# Altium project Phaser.PrjPCB (part 4 of 5)

## Sheet FPGA_DAC.SchDoc: Phaser
size 420 x 297 mm; EDA_Number: ARTIQ; Projet: ARTIQ/SINARA; Author: G.Kasprowicz; CompanyName: WUT ISE; DrawnBy: G.Kasprowicz; Organization: WUT ISE; Address1: PW ISE; Address2: Nowowiejska 15/19 00-665 Warsaw; Address3: gkasprow@gmail.com; Revision: 2; SheetNumber: -; SheetTotal: -; ModifiedBy: -; CheckedDate: -; Title2: xxx; DivGrp: WUT ISE; Designer: G.Kasprowicz; ModifiedDate: -; ProjectName: Sensor Box
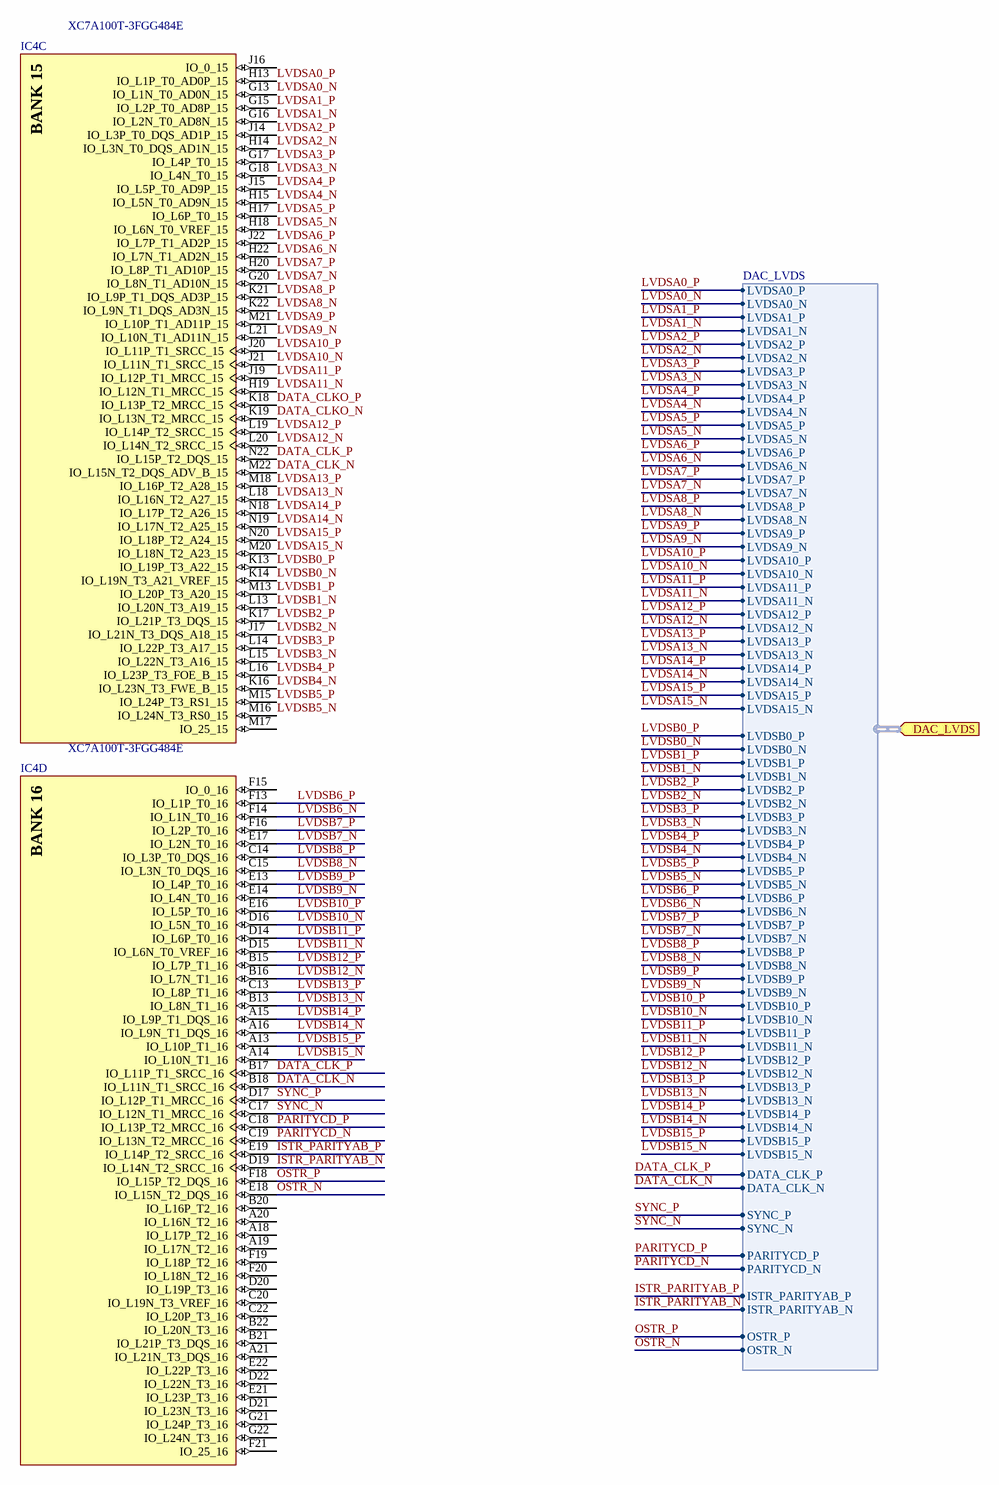
[diagram p8: FPGA_DAC.SchDoc]

### Parts
IC4  XC7A100T-3FGG484E  [FGG484]  (parts C,D of 10)

### Ports
DAC_LVDS (in, harness DAC_LVDS)

### Harnesses
DAC_LVDS: LVDSA0_P, LVDSA0_N, LVDSA1_P, LVDSA1_N, LVDSA2_P, LVDSA2_N, LVDSA3_P, LVDSA3_N, LVDSA4_P, LVDSA4_N, LVDSA5_P, LVDSA5_N, LVDSA6_P, LVDSA6_N, LVDSA7_P, LVDSA7_N, LVDSA8_P, LVDSA8_N, LVDSA9_P, LVDSA9_N, LVDSA10_P, LVDSA10_N, LVDSA11_P, LVDSA11_N, LVDSA12_P, LVDSA12_N, LVDSA13_P, LVDSA13_N, LVDSA14_P, LVDSA14_N, LVDSA15_P, LVDSA15_N, LVDSB0_P, LVDSB0_N, LVDSB1_P, LVDSB1_N, LVDSB2_P, LVDSB2_N, LVDSB3_P, LVDSB3_N, LVDSB4_P, LVDSB4_N, LVDSB5_P, LVDSB5_N, LVDSB6_P, LVDSB6_N, LVDSB7_P, LVDSB7_N, LVDSB8_P, LVDSB8_N, LVDSB9_P, LVDSB9_N, LVDSB10_P, LVDSB10_N, LVDSB11_P, LVDSB11_N, LVDSB12_P, LVDSB12_N, LVDSB13_P, LVDSB13_N, LVDSB14_P, LVDSB14_N, LVDSB15_P, LVDSB15_N, DATA_CLK_P, DATA_CLK_N, SYNC_P, SYNC_N, PARITYCD_P, PARITYCD_N, ISTR_PARITYAB_P, ISTR_PARITYAB_N, OSTR_P, OSTR_N

### Nets
DATA_CLK_N: IC4.B18(IO_L11N_T1_SRCC_16) IC4.M22(IO_L15N_T2_DQS_ADV_B_15) ; port DAC_LVDS.DATA_CLK_N
DATA_CLK_P: IC4.B17(IO_L11P_T1_SRCC_16) IC4.N22(IO_L15P_T2_DQS_15) ; port DAC_LVDS.DATA_CLK_P
DATA_CLKO_N: IC4.K19(IO_L13N_T2_MRCC_15)
DATA_CLKO_P: IC4.K18(IO_L13P_T2_MRCC_15)
ISTR_PARITYAB_N: IC4.D19(IO_L14N_T2_SRCC_16) ; port DAC_LVDS.ISTR_PARITYAB_N
ISTR_PARITYAB_P: IC4.E19(IO_L14P_T2_SRCC_16) ; port DAC_LVDS.ISTR_PARITYAB_P
LVDSA0_N: IC4.G13(IO_L1N_T0_AD0N_15) ; port DAC_LVDS.LVDSA0_N
LVDSA0_P: IC4.H13(IO_L1P_T0_AD0P_15) ; port DAC_LVDS.LVDSA0_P
LVDSA1_N: IC4.G16(IO_L2N_T0_AD8N_15) ; port DAC_LVDS.LVDSA1_N
LVDSA1_P: IC4.G15(IO_L2P_T0_AD8P_15) ; port DAC_LVDS.LVDSA1_P
LVDSA2_N: IC4.H14(IO_L3N_T0_DQS_AD1N_15) ; port DAC_LVDS.LVDSA2_N
LVDSA2_P: IC4.J14(IO_L3P_T0_DQS_AD1P_15) ; port DAC_LVDS.LVDSA2_P
LVDSA3_N: IC4.G18(IO_L4N_T0_15) ; port DAC_LVDS.LVDSA3_N
LVDSA3_P: IC4.G17(IO_L4P_T0_15) ; port DAC_LVDS.LVDSA3_P
LVDSA4_N: IC4.H15(IO_L5N_T0_AD9N_15) ; port DAC_LVDS.LVDSA4_N
LVDSA4_P: IC4.J15(IO_L5P_T0_AD9P_15) ; port DAC_LVDS.LVDSA4_P
LVDSA5_N: IC4.H18(IO_L6N_T0_VREF_15) ; port DAC_LVDS.LVDSA5_N
LVDSA5_P: IC4.H17(IO_L6P_T0_15) ; port DAC_LVDS.LVDSA5_P
LVDSA6_N: IC4.H22(IO_L7N_T1_AD2N_15) ; port DAC_LVDS.LVDSA6_N
LVDSA6_P: IC4.J22(IO_L7P_T1_AD2P_15) ; port DAC_LVDS.LVDSA6_P
LVDSA7_N: IC4.G20(IO_L8N_T1_AD10N_15) ; port DAC_LVDS.LVDSA7_N
LVDSA7_P: IC4.H20(IO_L8P_T1_AD10P_15) ; port DAC_LVDS.LVDSA7_P
LVDSA8_N: IC4.K22(IO_L9N_T1_DQS_AD3N_15) ; port DAC_LVDS.LVDSA8_N
LVDSA8_P: IC4.K21(IO_L9P_T1_DQS_AD3P_15) ; port DAC_LVDS.LVDSA8_P
LVDSA9_N: IC4.L21(IO_L10N_T1_AD11N_15) ; port DAC_LVDS.LVDSA9_N
LVDSA9_P: IC4.M21(IO_L10P_T1_AD11P_15) ; port DAC_LVDS.LVDSA9_P
LVDSA10_N: IC4.J21(IO_L11N_T1_SRCC_15) ; port DAC_LVDS.LVDSA10_N
LVDSA10_P: IC4.J20(IO_L11P_T1_SRCC_15) ; port DAC_LVDS.LVDSA10_P
LVDSA11_N: IC4.H19(IO_L12N_T1_MRCC_15) ; port DAC_LVDS.LVDSA11_N
LVDSA11_P: IC4.J19(IO_L12P_T1_MRCC_15) ; port DAC_LVDS.LVDSA11_P
LVDSA12_N: IC4.L20(IO_L14N_T2_SRCC_15) ; port DAC_LVDS.LVDSA12_N
LVDSA12_P: IC4.L19(IO_L14P_T2_SRCC_15) ; port DAC_LVDS.LVDSA12_P
LVDSA13_N: IC4.L18(IO_L16N_T2_A27_15) ; port DAC_LVDS.LVDSA13_N
LVDSA13_P: IC4.M18(IO_L16P_T2_A28_15) ; port DAC_LVDS.LVDSA13_P
LVDSA14_N: IC4.N19(IO_L17N_T2_A25_15) ; port DAC_LVDS.LVDSA14_N
LVDSA14_P: IC4.N18(IO_L17P_T2_A26_15) ; port DAC_LVDS.LVDSA14_P
LVDSA15_N: IC4.M20(IO_L18N_T2_A23_15) ; port DAC_LVDS.LVDSA15_N
LVDSA15_P: IC4.N20(IO_L18P_T2_A24_15) ; port DAC_LVDS.LVDSA15_P
LVDSB0_N: IC4.K14(IO_L19N_T3_A21_VREF_15) ; port DAC_LVDS.LVDSB0_N
LVDSB0_P: IC4.K13(IO_L19P_T3_A22_15) ; port DAC_LVDS.LVDSB0_P
LVDSB1_N: IC4.L13(IO_L20N_T3_A19_15) ; port DAC_LVDS.LVDSB1_N
LVDSB1_P: IC4.M13(IO_L20P_T3_A20_15) ; port DAC_LVDS.LVDSB1_P
LVDSB2_N: IC4.J17(IO_L21N_T3_DQS_A18_15) ; port DAC_LVDS.LVDSB2_N
LVDSB2_P: IC4.K17(IO_L21P_T3_DQS_15) ; port DAC_LVDS.LVDSB2_P
LVDSB3_N: IC4.L15(IO_L22N_T3_A16_15) ; port DAC_LVDS.LVDSB3_N
LVDSB3_P: IC4.L14(IO_L22P_T3_A17_15) ; port DAC_LVDS.LVDSB3_P
LVDSB4_N: IC4.K16(IO_L23N_T3_FWE_B_15) ; port DAC_LVDS.LVDSB4_N
LVDSB4_P: IC4.L16(IO_L23P_T3_FOE_B_15) ; port DAC_LVDS.LVDSB4_P
LVDSB5_N: IC4.M16(IO_L24N_T3_RS0_15) ; port DAC_LVDS.LVDSB5_N
LVDSB5_P: IC4.M15(IO_L24P_T3_RS1_15) ; port DAC_LVDS.LVDSB5_P
LVDSB6_N: IC4.F14(IO_L1N_T0_16) ; port DAC_LVDS.LVDSB6_N
LVDSB6_P: IC4.F13(IO_L1P_T0_16) ; port DAC_LVDS.LVDSB6_P
LVDSB7_N: IC4.E17(IO_L2N_T0_16) ; port DAC_LVDS.LVDSB7_N
LVDSB7_P: IC4.F16(IO_L2P_T0_16) ; port DAC_LVDS.LVDSB7_P
LVDSB8_N: IC4.C15(IO_L3N_T0_DQS_16) ; port DAC_LVDS.LVDSB8_N
LVDSB8_P: IC4.C14(IO_L3P_T0_DQS_16) ; port DAC_LVDS.LVDSB8_P
LVDSB9_N: IC4.E14(IO_L4N_T0_16) ; port DAC_LVDS.LVDSB9_N
LVDSB9_P: IC4.E13(IO_L4P_T0_16) ; port DAC_LVDS.LVDSB9_P
LVDSB10_N: IC4.D16(IO_L5N_T0_16) ; port DAC_LVDS.LVDSB10_N
LVDSB10_P: IC4.E16(IO_L5P_T0_16) ; port DAC_LVDS.LVDSB10_P
LVDSB11_N: IC4.D15(IO_L6N_T0_VREF_16) ; port DAC_LVDS.LVDSB11_N
LVDSB11_P: IC4.D14(IO_L6P_T0_16) ; port DAC_LVDS.LVDSB11_P
LVDSB12_N: IC4.B16(IO_L7N_T1_16) ; port DAC_LVDS.LVDSB12_N
LVDSB12_P: IC4.B15(IO_L7P_T1_16) ; port DAC_LVDS.LVDSB12_P
LVDSB13_N: IC4.B13(IO_L8N_T1_16) ; port DAC_LVDS.LVDSB13_N
LVDSB13_P: IC4.C13(IO_L8P_T1_16) ; port DAC_LVDS.LVDSB13_P
LVDSB14_N: IC4.A16(IO_L9N_T1_DQS_16) ; port DAC_LVDS.LVDSB14_N
LVDSB14_P: IC4.A15(IO_L9P_T1_DQS_16) ; port DAC_LVDS.LVDSB14_P
LVDSB15_N: IC4.A14(IO_L10N_T1_16) ; port DAC_LVDS.LVDSB15_N
LVDSB15_P: IC4.A13(IO_L10P_T1_16) ; port DAC_LVDS.LVDSB15_P
OSTR_N: IC4.E18(IO_L15N_T2_DQS_16) ; port DAC_LVDS.OSTR_N
OSTR_P: IC4.F18(IO_L15P_T2_DQS_16) ; port DAC_LVDS.OSTR_P
PARITYCD_N: IC4.C19(IO_L13N_T2_MRCC_16) ; port DAC_LVDS.PARITYCD_N
PARITYCD_P: IC4.C18(IO_L13P_T2_MRCC_16) ; port DAC_LVDS.PARITYCD_P
SYNC_N: IC4.C17(IO_L12N_T1_MRCC_16) ; port DAC_LVDS.SYNC_N
SYNC_P: IC4.D17(IO_L12P_T1_MRCC_16) ; port DAC_LVDS.SYNC_P

Not connected (* = marked no-connect by the designer): IC4 A18(IO_L17P_T2_16) A19(IO_L17N_T2_16) A20(IO_L16N_T2_16) A21(IO_L21N_T3_DQS_16) B20(IO_L16P_T2_16) B21(IO_L21P_T3_DQS_16) B22(IO_L20N_T3_16) C20(IO_L19N_T3_VREF_16) C22(IO_L20P_T3_16) D20(IO_L19P_T3_16) D21(IO_L23N_T3_16) D22(IO_L22N_T3_16) E21(IO_L23P_T3_16) E22(IO_L22P_T3_16) F15(IO_0_16) F19(IO_L18P_T2_16) F20(IO_L18N_T2_16) F21(IO_25_16) G21(IO_L24P_T3_16) G22(IO_L24N_T3_16) J16(IO_0_15) M17(IO_25_15)

### Notes on the sheet
- Project/Equipment
- Document
- Designer
- Drawn by
- Check.by
- Copyright WUT ISE 2018.
  This documentation describes Open Hardware and is licensed under the CERN OHL v.1.1. You may redistribute and modify this documentation under the terms of the CERN OHL v.1.1. (http://ohwr.org/CERNOHL). This documentation is distributed WITHOUT ANY EXPRESS OR IMPLIED WARRANTY, INCLUDING OF MERCHANTABILITY, SATISFACTORY QUALITY AND FITNESS FOR A PARTICULAR PURPOSE. Please see the CERN OHL v.1.1 for applicable conditions.
- Contact
- File
- Last Mod.
- Print Date
- Sheet
- Size
- A3
- of
- Rev
- (in symbol CMP-0364-00028-3, part C) BANK 15
- (in symbol CMP-0364-00028-3, part D) BANK 16

### Library data of the parts
IC4 = CMP-0364-00028-3: Artix-7 FPGA, 285 User I/Os, 4 GTP, 484-Ball BGA, Speed Grade 3, Extended Grade, Pb-Free; Manufacturer: Xilinx; Max User I/O: 300; Clock Mgmt Tiles (CMTs): 6; Logic Cells: 101440; Block RAM Blocks (36Kb): 135; Block RAM Blocks (18Kb): 270; Speed Grade: -3; CLBs (Slices): 15850; Block RAM Blocks (Max Kb): 4860; DSP48E1 Slices: 240; RoHS: Pb-Free; ComponentLink3URL: http://www.xilinx.com/support/documentation/data_sheets/ds181_Artix_7_Data_Sheet.pdf; NexusDeviceID: XC7A100T-3FGG484E; DatasheetVersion: v1.12; Mounting Technology: Surface Mount; PackageDescription: Wire-Bond Fine-Pitch BGA, Body 23 x 23 mm, 1.0 mm Pitch; PackageReference: FGG484; ComponentLink2Description: Package Specification; Code_JEDEC: MS-034-AAJ-1; ComponentLink2URL: http://www.xilinx.com/support/documentation/user_guides/ug475_7Series_Pkg_Pinout.pdf; ComponentLink3Description: DC and Switching Characteristics; Generic Part Number: XC7A100T; ComponentLink4Description: Package File; ComponentLink4URL: http://www.xilinx.com/support/packagefiles/a7packages/xc7a100tfgg484pkg.txt; ComponentLink1URL: http://www.xilinx.com/support/documentation/data_sheets/ds180_7Series_Overview.pdf; PartNumber: XC7A100T-3FGG484E; ComponentLink5URL: http://www.xilinx.com/support/documentation/user_guides/ug475_7Series_Pkg_Pinout.pdf; PackageVersion: Rev 1.8; ComponentLink5Description: Packaging and Pinout; ComponentLink1Description: Datasheet; CLBs (Max Distributed RAM Kb): 1188

## Sheet DAC_SUPPLY.SchDoc: Phaser
size 420 x 297 mm; Author: G.Kasprowicz; CompanyName: WUT ISE; DrawnBy: G.Kasprowicz; Organization: WUT ISE; Address1: PW ISE; Address2: Nowowiejska 15/19 00-665 Warsaw; Address3: gkasprow@gmail.com; Revision: 2; SheetNumber: -; SheetTotal: -; ModifiedBy: -; CheckedDate: -; Title2: xxx; DivGrp: WUT ISE; Designer: G.Kasprowicz; ModifiedDate: -; ProjectName: Sensor Box
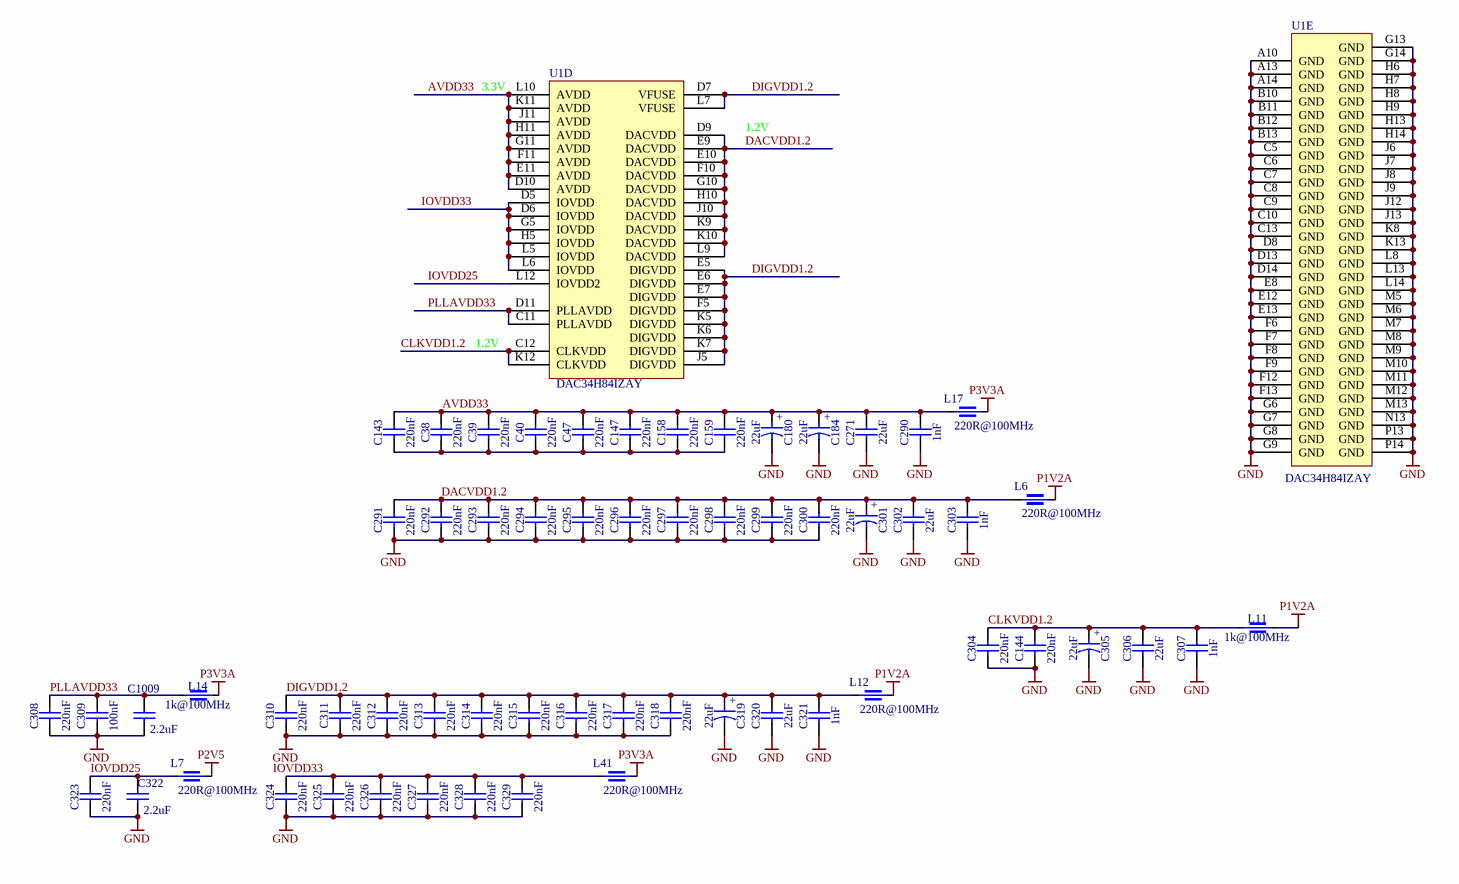
[diagram p9: DAC_SUPPLY.SchDoc]

### Parts
C38  220nF  [CAPC0603X33N]
C39  220nF  [CAPC0603X33N]
C40  220nF  [CAPC0603X33N]
C47  220nF  [CAPC0603X33N]
C143  220nF  [CAPC0603X33N]
C144  220nF  [CAPC0603X33N]
C147  220nF  [CAPC0603X33N]
C158  220nF  [CAPC0603X33N]
C159  220nF  [CAPC0603X33N]
C180  22uF  [CAPMP3528X210N]
C184  22uF  [CAPMP3528X210N]
C271  22uF  [CAPC1709X100N]
C290  1nF  [CAPC1005X55N]
C291  220nF  [CAPC0603X33N]
C292  220nF  [CAPC0603X33N]
C293  220nF  [CAPC0603X33N]
C294  220nF  [CAPC0603X33N]
C295  220nF  [CAPC0603X33N]
C296  220nF  [CAPC0603X33N]
C297  220nF  [CAPC0603X33N]
C298  220nF  [CAPC0603X33N]
C299  220nF  [CAPC0603X33N]
C300  220nF  [CAPC0603X33N]
C301  22uF  [CAPMP3528X210N]
C302  22uF  [CAPC1709X100N]
C303  1nF  [CAPC1005X55N]
C304  220nF  [CAPC0603X33N]
C305  22uF  [CAPMP3528X210N]
C306  22uF  [CAPC1709X100N]
C307  1nF  [CAPC1005X55N]
C308  220nF  [CAPC0603X33N]
C309  100nF  [CAPC1608X90N]
C310  220nF  [CAPC0603X33N]
C311  220nF  [CAPC0603X33N]
C312  220nF  [CAPC0603X33N]
C313  220nF  [CAPC0603X33N]
C314  220nF  [CAPC0603X33N]
C315  220nF  [CAPC0603X33N]
C316  220nF  [CAPC0603X33N]
C317  220nF  [CAPC0603X33N]
C318  220nF  [CAPC0603X33N]
C319  22uF  [CAPMP3528X210N]
C320  22uF  [CAPC1709X100N]
C321  1nF  [CAPC1005X55N]
C322  2.2uF  [CAPC1005X55N]
C323  220nF  [CAPC0603X33N]
C324  220nF  [CAPC0603X33N]
C325  220nF  [CAPC0603X33N]
C326  220nF  [CAPC0603X33N]
C327  220nF  [CAPC0603X33N]
C328  220nF  [CAPC0603X33N]
C329  220nF  [CAPC0603X33N]
C1009  2.2uF  [CAPC1005X55N]
L6  220R@100MHz  [INDC1608X95N]
L7  220R@100MHz  [INDC1608X95N]
L11  1k@100MHz  [INDC1005X55N]
L12  220R@100MHz  [INDC1608X95N]
L14  1k@100MHz  [INDC1005X55N]
L17  220R@100MHz  [INDC1608X95N]
L41  220R@100MHz  [INDC1608X95N]
U1  DAC34H84IZAY  [TI-ZAY196]  (parts D,E of 5)

### Nets
GND: C144.1 C180.2 C184.2 C271.1 C290.1 C291.1 C292.1 C293.1 C294.1 C295.1 C296.1 C297.1 C298.1 C299.1 C300.1 C301.2 C302.1 C303.1 C304.1 C305.2 C306.1 C307.1 C308.1 C309.1 C310.1 C311.1 C312.1 C313.1 C314.1 C315.1 C316.1 C317.1 C318.1 C319.2 C320.1 C321.1 C322.1 C323.1 C324.1 C325.1 C326.1 C327.1 C328.1 C329.1 C1009.1 U1.A10(GND) U1.A13(GND) U1.A14(GND) U1.B10(GND) U1.B11(GND) U1.B12(GND) U1.B13(GND) U1.C5(GND) U1.C6(GND) U1.C7(GND) U1.C8(GND) U1.C9(GND) U1.C10(GND) U1.C13(GND) U1.D8(GND) U1.D13(GND) U1.D14(GND) U1.E8(GND) U1.E12(GND) U1.E13(GND) U1.F6(GND) U1.F7(GND) U1.F8(GND) U1.F9(GND) U1.F12(GND) U1.F13(GND) U1.G6(GND) U1.G7(GND) U1.G8(GND) U1.G9(GND) U1.G13(GND) U1.G14(GND) U1.H6(GND) U1.H7(GND) U1.H8(GND) U1.H9(GND) U1.H13(GND) U1.H14(GND) U1.J6(GND) U1.J7(GND) U1.J8(GND) U1.J9(GND) U1.J12(GND) U1.J13(GND) U1.K8(GND) U1.K13(GND) U1.L8(GND) U1.L13(GND) U1.L14(GND) U1.M5(GND) U1.M6(GND) U1.M7(GND) U1.M8(GND) U1.M9(GND) U1.M10(GND) U1.M11(GND) U1.M12(GND) U1.M13(GND) U1.N13(GND) U1.P13(GND) U1.P14(GND)
P1V2A: L6.2 L11.2 L12.2
P2V5: L7.2
P3V3A: L14.2 L17.2 L41.2
AVDD33: C38.2 C39.2 C40.2 C47.2 C143.2 C147.2 C158.2 C159.2 C180.1 C184.1 C271.2 C290.2 L17.1 U1.D10(AVDD) U1.E11(AVDD) U1.F11(AVDD) U1.G11(AVDD) U1.H11(AVDD) U1.J11(AVDD) U1.K11(AVDD) U1.L10(AVDD)
CLKVDD1.2: C144.2 C304.2 C305.1 C306.2 C307.2 L11.1 U1.C12(CLKVDD) U1.K12(CLKVDD)
DACVDD1.2: C291.2 C292.2 C293.2 C294.2 C295.2 C296.2 C297.2 C298.2 C299.2 C300.2 C301.1 C302.2 C303.2 L6.1 U1.D9(DACVDD) U1.E9(DACVDD) U1.E10(DACVDD) U1.F10(DACVDD) U1.G10(DACVDD) U1.H10(DACVDD) U1.J10(DACVDD) U1.K9(DACVDD) U1.K10(DACVDD) U1.L9(DACVDD)
DIGVDD1.2: C310.2 C311.2 C312.2 C313.2 C314.2 C315.2 C316.2 C317.2 C318.2 C319.1 C320.2 C321.2 L12.1 U1.D7(VFUSE) U1.E5(DIGVDD) U1.E6(DIGVDD) U1.E7(DIGVDD) U1.F5(DIGVDD) U1.J5(DIGVDD) U1.K5(DIGVDD) U1.K6(DIGVDD) U1.K7(DIGVDD) U1.L7(VFUSE)
IOVDD25: C322.2 C323.2 L7.1 U1.L12(IOVDD2)
IOVDD33: U1.D5(IOVDD) U1.D6(IOVDD) U1.G5(IOVDD) U1.H5(IOVDD) U1.L5(IOVDD) U1.L6(IOVDD)
PLLAVDD33: C308.2 C309.2 C1009.2 L14.1 U1.C11(PLLAVDD) U1.D11(PLLAVDD)
NetC38_1: C38.1 C39.1 C40.1 C47.1 C143.1 C147.1 C158.1 C159.1
NetC324_2: C324.2 C325.2 C326.2 C327.2 C328.2 C329.2 L41.1

### Notes on the sheet
- (near U1) 3.3V
- 1.2V
- Labels drawn without touching a wire or pin: IOVDD33
- Project/Equipment
- Document
- Designer
- Drawn by
- Check.by
- Copyright WUT ISE 2018.
  This documentation describes Open Hardware and is licensed under the CERN OHL v.1.1. You may redistribute and modify this documentation under the terms of the CERN OHL v.1.1. (http://ohwr.org/CERNOHL). This documentation is distributed WITHOUT ANY EXPRESS OR IMPLIED WARRANTY, INCLUDING OF MERCHANTABILITY, SATISFACTORY QUALITY AND FITNESS FOR A PARTICULAR PURPOSE. Please see the CERN OHL v.1.1 for applicable conditions.
- Contact
- File
- Last Mod.
- Print Date
- Sheet
- Size
- A3
- of
- Rev
- (in symbol CTE3528-21_22UF_10V_10%_LESR0700) +

### Library data of the parts
C38-C40 C47 C143 C144 C147 C158 C159 C291-C300 C304 C308 C310-C318 C323-C329 = CC0201_220NF_6.3V_20%_X5R: Non-polarised capacitor; Part Description: SMD Multilayer Chip Ceramic Capacitor; Manufacturer: GENERIC; Manufacturer1 Part Number: JMK063BJ224MP-F; Voltage: 6.3V; TC: X5R; Tolerance: ±20%; Part Number: CC0201_220NF_6.3V_20%_X5R; Component Kind: Standard; Component Type: Standard; Pin Count: 2; Value: 220nF; Status: Not Recommended; Manufacturer Part Number: CC0201_220NF_6.3V_20%_X5R; Case: 0201; Mounted: Yes; Socket: No; SMD: Yes; Sense: No; Manufacturer1 Example: TAIYO YUDEN; Manufacturer1 ComponentHeight: 0.33mm; HelpURL: \\cern.ch\dfs\Applications\Altium\Datasheets\CC0201_X5R_TAIYO-YUDEN_STANDARD-CLASS2.pdf; Author: CERN DEM JLC; CreateDate: 27.05.2010; LatestRevisionDate: 27.05.2010
C180 C184 C301 C305 C319 = CTE3528-21_22UF_10V_10%_LESR0700: Polarised capacitor; Part Description: Low ESR 0R7 Solid Tantalum Chip Capacitor; Manufacturer: GENERIC; Manufacturer1 Part Number: TPSB226K010R0700; Voltage: 10V; Tolerance: ±10%; Part Number: CTE3528-21_22UF_10V_10%_LESR0700; Component Kind: Standard; Component Type: Standard; Pin Count: 2; Value: 22uF; Status: Preferred; Manufacturer Part Number: CTE3528-21_22UF_10V_10%_LESR0700; Case: B; Mounted: Yes; Socket: No; SMD: Yes; Sense: No; Manufacturer1 Example: AVX; Manufacturer1 ComponentHeight: 2.1mm; HelpURL: \\cern.ch\dfs\Applications\Altium\Datasheets\CTE-LESR_AVX_TPS.pdf; Author: CERN DEM JLC; CreateDate: 05.05.2008; LatestRevisionDate: 20.01.2009
C271 C302 C306 C320 = CC0603_22UF_6.3V_20%_X5R: Non-polarised capacitor; Part Description: SMD Multilayer Chip Ceramic Capacitor; Manufacturer: GENERIC; Manufacturer1 Part Number: C1608X5R0J226M080AC; Voltage: 6.3V; TC: X5R; Tolerance: ±20%; Part Number: CC0603_22UF_6.3V_20%_X5R; Component Kind: Standard; Component Type: Standard; Pin Count: 2; Value: 22uF; Status: None; Manufacturer Part Number: CC0603_22UF_6.3V_20%_X5R; Case: 0603; Mounted: Yes; Socket: No; SMD: Yes; Sense: No; Manufacturer1 Example: TDK; Manufacturer1 ComponentHeight: 1mm; HelpURL: \\cern.ch\dfs\Applications\Altium\Datasheets\CC0603_X5R_TDK_C.pdf; Author: CERN DEM JLC; CreateDate: 16.12.2013; LatestRevisionDate: 13.09.2016
C290 C303 C307 C321 = CC0402_1NF_50V_10%_X7R: Non-polarised capacitor; Part Description: SMD Multilayer Chip Ceramic Capacitor; Manufacturer: GENERIC; Manufacturer1 Part Number: 223858715623; Voltage: 50V; TC: X7R; Tolerance: ±10%; Part Number: CC0402_1NF_50V_10%_X7R; Component Kind: Standard; Component Type: Standard; Pin Count: 2; Value: 1nF; Status: Not Recommended; Manufacturer Part Number: CC0402_1NF_50V_10%_X7R; Case: 0402; Mounted: Yes; Socket: No; SMD: Yes; Sense: No; Manufacturer1 Example: PHYCOMP; Manufacturer1 ComponentHeight: 0.55mm; HelpURL: \\cern.ch\dfs\Applications\Altium\Datasheets\CC0402_X7R_PHYCOMP.pdf; Author: CERN DEM JLC; CreateDate: 03.12.2007; LatestRevisionDate: 03.12.2007
C309 = CC0603_100NF_100V_10%_X7R: Non-polarised capacitor; Part Description: SMD Multilayer Chip Ceramic Capacitor; Manufacturer: GENERIC; Manufacturer1 Part Number: GRM188R72A104KA35D; Voltage: 100V; TC: X7R; Tolerance: ±10%; Part Number: CC0603_100NF_100V_10%_X7R; Component Kind: Standard; Component Type: Standard; Pin Count: 2; Value: 100nF; Status: None; Manufacturer Part Number: CC0603_100NF_100V_10%_X7R; Case: 0603; Mounted: Yes; Socket: No; SMD: Yes; Sense: No; Manufacturer1 Example: MURATA; Manufacturer1 ComponentHeight: 0.9mm; HelpURL: \\cern.ch\dfs\Applications\Altium\Datasheets\CC0603_MURATA_GRM188R72A104KA35D.pdf; Author: CERN DEM JLC; CreateDate: 11.12.2013; LatestRevisionDate: 11.12.2013
C322 C1009 = CC0402_2.2UF_6.3V_10%_X5R: Non-polarised capacitor; Part Description: SMD Multilayer Chip Ceramic Capacitor; Manufacturer: GENERIC; Manufacturer1 Part Number: C1005X5R0J225K050BC; Voltage: 6.3V; TC: X5R; Tolerance: ±10%; Part Number: CC0402_2.2UF_6.3V_10%_X5R; Component Kind: Standard; Component Type: Standard; Pin Count: 2; Value: 2.2uF; Status: Preferred; Manufacturer Part Number: CC0402_2.2UF_6.3V_10%_X5R; Case: 0402; Mounted: Yes; Socket: No; SMD: Yes; Sense: No; Manufacturer1 Example: TDK; Manufacturer1 ComponentHeight: 0.55mm; HelpURL: \\cern.ch\dfs\Applications\Altium\Datasheets\CC0402_X5R_TDK_C.pdf; Author: CERN DEM JMW; CreateDate: 22.09.2015; LatestRevisionDate: 22.09.2015
L6 L7 L12 L17 L41 = IND0603_MURATA_BLM18SG221TN1: Part Description: SMD EMIFIL Suppression Chip Ferrite Bead; Manufacturer: MURATA; Power: 2.5A; Resistance: 0.04R; Tolerance: ±25%; Part Number: IND0603_MURATA_BLM18SG221TN1; Component Kind: Standard; Component Type: Standard; Pin Count: 2; Value: 220R@100MHz; Status: None; Manufacturer Part Number: BLM18SG221TN1; Case: 0603; Mounted: Yes; Socket: No; SMD: Yes; Sense: No; ComponentHeight: 0.95mm; HelpURL: \\cern.ch\dfs\Applications\Altium\Datasheets\IND0603_MURATA_BLM18S.pdf; Author: CERN DEM MR; CreateDate: 08.01.2016; LatestRevisionDate: 25.10.2018
L11 L14 = IND0402_MURATA_BLM15HD102SN1: Part Description: SMD EMIFIL Suppression Chip Ferrite Bead; Manufacturer: MURATA; Manufacturer Part Number: BLM15HD102SN1D; Power: 250mA; Resistance: 1.25R; Tolerance: ±25%; Part Number: IND0402_MURATA_BLM15HD102SN1; Component Kind: Standard; Component Type: Standard; Pin Count: 2; Value: 1k@100MHz; Status: None; Case: 0402; Mounted: Yes; Socket: No; SMD: Yes; Sense: No; ComponentHeight: 0.55mm; HelpURL: \\cern.ch\dfs\Applications\Altium\Datasheets\IND0402_MURATA_BLM15H.pdf; Author: CERN DEM JLC; CreateDate: 06.03.2012; LatestRevisionDate: 25.10.2018
U1 = CMP-0004-01532-1: Quad-Channel, 16-Bit, 1.5 GSPS DAC, -40 to 85 degC, 196-pin BGA (ZAY196), Green (RoHS & no Sb/Br); Manufacturer: Texas Instruments; Interface: Parallel LVDS; Resolution(Bits): 16; SubFamily: High Speed DAC (>10MSPS); Power Consumption(Typ)(mW): 1828; SFDR(dB): 78; DAC Channels: 4; Mounting Technology: Surface Mount; ComponentLink3URL: http://www.ti.com/litv/pdf/mpbga11; PartNumber: DAC34H84IZAY; ComponentLink1Description: Manufacturer URL; Eco-Plan: Green (RoHS & no Sb/Br); PackageDescription: 196-Pin Plastic Ball Grid Array, Body 12 x 12 mm, Pitch 0.8 mm; PackageVersion: 4208324-4/C, 09/2010; PackageReference: ZAY196; ComponentLink1URL: http://www.ti.com/; ComponentLink2URL: http://www.ti.com/general/docs/lit/getliterature.tsp?genericPartNumber=DAC34SH84&fileType=pdf; DatasheetVersion: SLAS808D; ComponentLink3Description: Package Specification; ComponentLink2Description: Datasheet